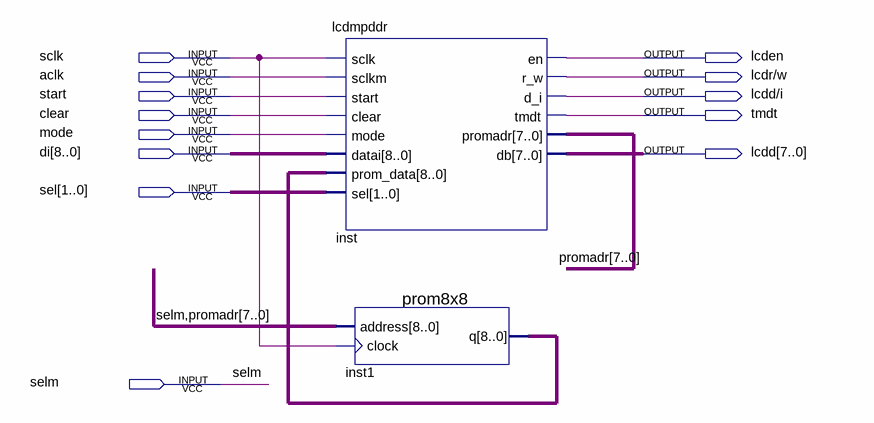
[diagram p0: schematic sheet]
// Quartus schematic lcmddr.bdf as structural Verilog: 2 symbols, 13 pins
module lcmddr (
  input  sclk,
  input  aclk,
  input  start,
  input  clear,
  input  mode,
  input  [8:0] di,
  input  [1:0] sel,
  input  selm,
  output lcden,
  output \lcdr/w ,
  output \lcdd/i ,
  output tmdt,
  output [7:0] lcdd
);

  wire [7:0] promadr;
  wire [8:0] inst1_q;

  lcdmpddr inst (
    .sclk(sclk), .sclkm(aclk), .start(start), .clear(clear), .mode(mode), .datai(di), .prom_data(inst1_q),
    .sel(sel), .en(lcden), .r_w(\lcdr/w ), .d_i(\lcdd/i ), .tmdt(tmdt), .promadr(promadr), .db(lcdd));
  prom8x8 inst1 (.address({selm, promadr}), .clock(sclk), .q(inst1_q));
endmodule
